# EAGLE design main06kaikai (EAGLE 7.4.0)
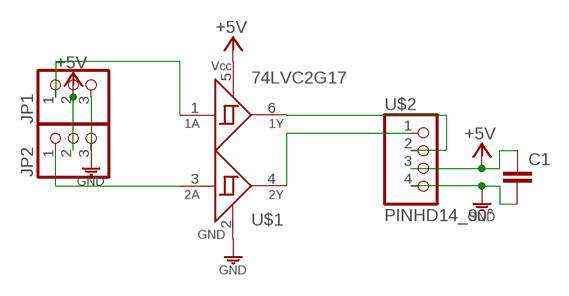
[diagram p0: schematic, sheet 1]

## Parts
C1  MLCC-2  [MLCC_25]
JP1  PINHD-13_90°  [1*3_90]
JP2  PINHD-13_90°  [1*3_90]
U$1  74LVC2G17  [74LVC2G17]
U$2  PINHD14_90°  [1*4_90]

## Nets
+5V: C1.1 JP1.2 JP2.2 U$1.5 U$2.3
GND: C1.2 JP1.3 JP2.3 U$1.2 U$2.4
N$1: U$1.6 U$2.2
N$2: U$1.4 U$2.1
N$3: JP1.1 U$1.1
N$4: JP2.1 U$1.3

## Library data of the parts
C1 = rcl__s:MLCC: CAPACITOR, European symbol
JP1 JP2 = pinhead_s:PINHD-1*3_90°
U$1 = 74LVC2G17:74LVC2G17
U$2 = pinhead_s:PINHD1*4_90°

## Board
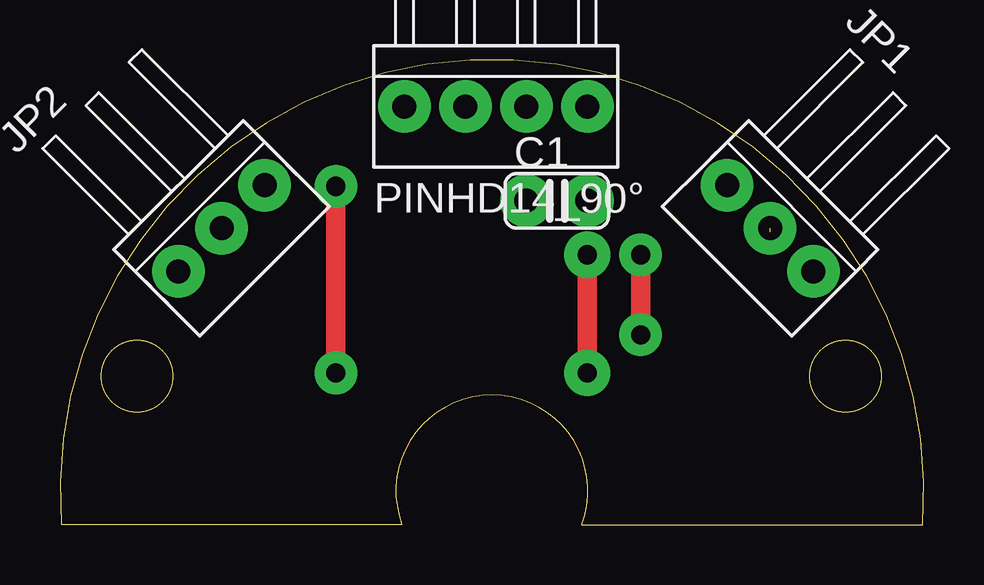
[diagram p1: board, top side]
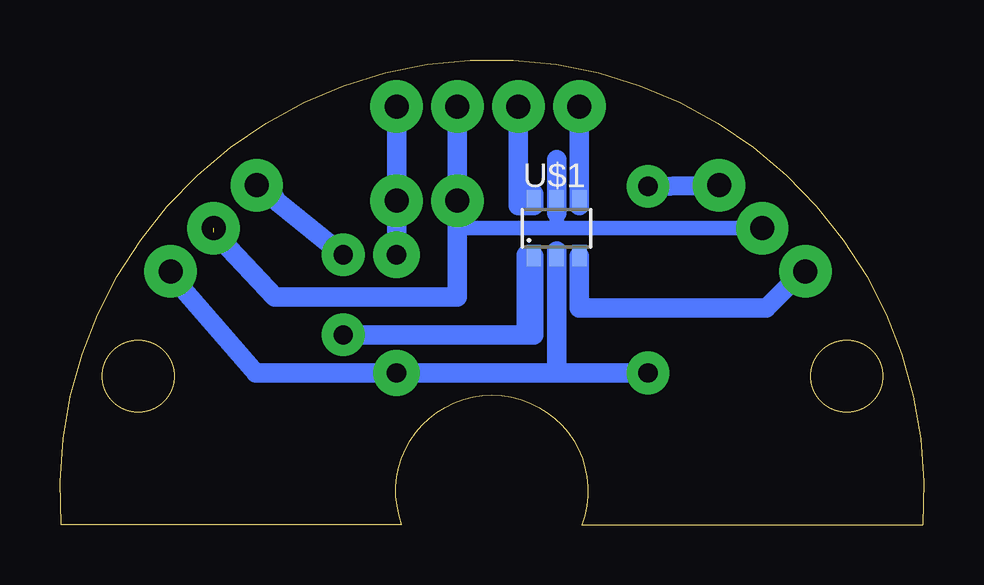
[diagram p2: board, bottom side, seen from below]

Size 35.99 x 19.39 mm. Coordinates in mm from the lower left corner, seen from the top.
Outline: 21.74,0 35.94,0 arc189 0.05,0 14.25,0 arc-221 21.74,0
Outline: circle at 32.73,6.2 radius 1.5
Outline: circle at 3.21,6.2 radius 1.5
Copper layers (1*16): Top 0.035mm / dielectric 1.5mm / Bottom 0.035mm
Design rules "default": minimum track width 10mil, minimum drill 24mil, track to track 8mil, track to pad 8mil, pad to pad 8mil, via to via 8mil, smd to smd 8mil, copper to edge 40mil, drill to drill 8mil, minimum pad ring 10mil, minimum via ring 8mil, stop-mask expansion 4mil, vias tented up to drill 0mil, thermal gap 10mil

### Footprints (pad centres in the part's own frame; a part is rotated, then mirrored left to right if it is on the bottom)
MLCC_25 = drill 1 pad 2.184: 1 -1.27,0; 2 1.27,0
1*3_90 = drill 1 pad 2.184: 1 -2.54,0; 2 0,0; 3 2.54,0
74LVC2G17 = smd 0.6 x 0.9: 1 -0.95,-1.15; 2 0,-1.15; 3 0.95,-1.15; 4 0.95,1.15; 5 0,1.15; 6 -0.95,1.15
1*4_90 = drill 1 pad 2.184: 1 -3.81,0; 2 -1.27,0; 3 1.27,0; 4 3.81,0

### Placement (x,y rotation side)
C1  20.7,13.51 0 top
JP1  29.59,12.37 315 top
JP2  6.73,12.37 45 top
U$1  15.3,12.37 0 bottom
U$2  18.16,17.45 0 top

### Tracks (layer width: path | path; a pad name or v marks a point on that pad's centre or on a via)
+5V  (1 unrouted)
  Bottom 0.61: JP2.2 15.3,12.37 | U$1.5 15.3,13 15.3,12.37 | 15.3,12.37 19.43,12.37 | 19.43,12.37 C1.1 19.43,13.64 | 19.43,12.37 19.43,9.51
  Bottom 0.813: U$2.3 19.43,13.64 19.43,9.51 27.05,9.51 29.59,12.21 | 15.3,13 15.3,15.23
GND  (via drill 0.8 pad 1.78, 0.8 pad 1.93)
  Top 0.813: v21.97,6.34 v21.97,11.26 | v11.49,6.34 v11.49,14.12
  Bottom 0.61: 15.3,6.65 U$1.2 15.3,11.42
  Bottom 0.813: v21.97,11.26 C1.2 U$2.4 | v11.49,6.34 15.3,6.34 | 15.3,6.34 v21.97,6.34 27.84,6.34 31.5,10.57 JP1.3 | 15.3,11.42 15.3,6.65 15.3,6.34 | v11.49,14.12 JP2.3
N$1
  Bottom 0.61: U$1.6 16.89,13.48 16.89,13.8
  Bottom 0.813: U$2.2 16.89,13.8 | 16.89,13.8 16.89,13.32 16.26,13.32 16.26,13.8 16.89,13.8
N$2
  Bottom 0.61: U$1.4 U$2.1
  Bottom 0.813: U$2.1 14.35,13.32
N$3  (via drill 0.8 pad 1.78)
  Top 0.813: v24.19,7.92 v24.19,11.26
  Bottom 0.813: U$1.1 16.26,7.92 v24.19,7.92 | v24.19,11.26 JP1.1
N$4
  Bottom 0.813: JP2.1 5.03,10.57 6.57,9.04 14.35,9.04 U$1.3
N$5
  Bottom 0.61: 15.3,13.64 15.3,14.75
N$6
  Bottom 0.813: 27.05,13.64 27.69,14.12
N$10
  Bottom 0.813: 16.57,11.26 16.57,8.24